# EAGLE design nsl_biz_card (EAGLE 6.4)
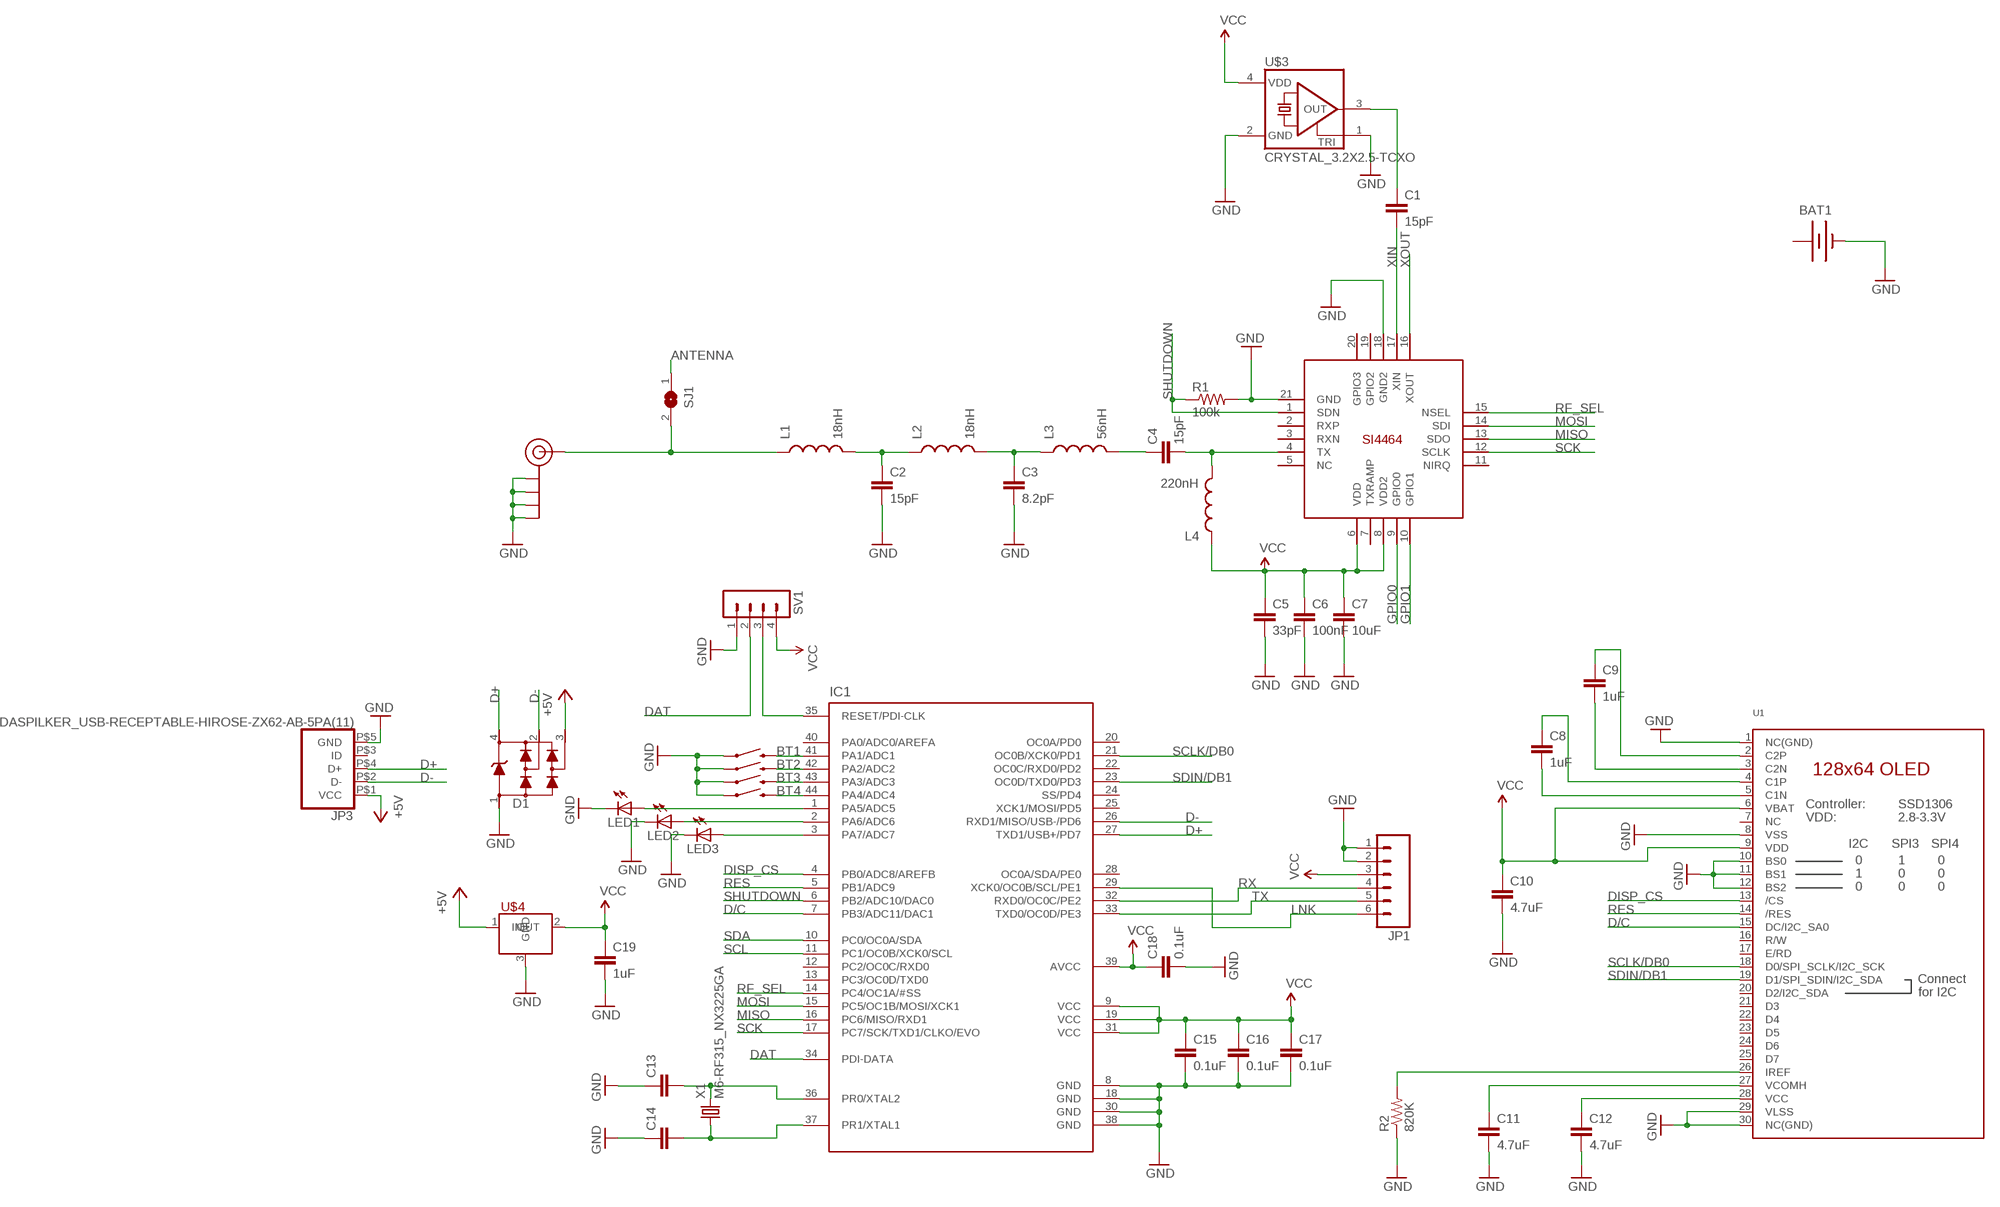
[diagram p0: schematic, sheet 1]

## Parts
BAT1  BATTERY12MM  [BATTCON_12MM]
C1  15pF  CAP0603-CAP  [0603-CAP]
C2  15pF  CAP0603-CAP  [0603-CAP]
C3  8.2pF  CAP0603-CAP  [0603-CAP]
C4  15pF  CAP0603-CAP  [0603-CAP]
C5  33pF  CAP0603-CAP  [0603-CAP]
C6  100nF  CAP0603-CAP  [0603-CAP]
C7  10uF  CAP0603-CAP  [0603-CAP]
C8  1uF  CAP0603-CAP  [0603-CAP]
C9  1uF  CAP0603-CAP  [0603-CAP]
C10  4.7uF  CAP0603-CAP  [0603-CAP]
C11  4.7uF  CAP0603-CAP  [0603-CAP]
C12  4.7uF  CAP0603-CAP  [0603-CAP]
C13  SPARKFUN_CAP0603-CAP  [SPARKFUN_0603-CAP]
C14  SPARKFUN_CAP0603-CAP  [SPARKFUN_0603-CAP]
C15  0.1uF  SPARKFUN_CAP0603-CAP  [SPARKFUN_0603-CAP]
C16  0.1uF  SPARKFUN_CAP0603-CAP  [SPARKFUN_0603-CAP]
C17  0.1uF  SPARKFUN_CAP0603-CAP  [SPARKFUN_0603-CAP]
C18  0.1uF  SPARKFUN_CAP0603-CAP  [SPARKFUN_0603-CAP]
C19  1uF  SPARKFUN_CAP0603-CAP  [SPARKFUN_0603-CAP]
D1  USBUG_PRTR5V0U2X  [USBUG_SOT143B]
IC1  OUTLINE_NONOLITH_ATXMEGAXXA4U-AU  [OUTLINE_NONOLITH_TQFP-44]
J$1  SMA_EDGE  [SMA-EDGE]
JP1  M06SIP  [1X06]
JP3  DASPILKER_USB-RECEPTABLE-HIROSE-ZX62-AB-5PA(11)  [DASPILKER_HIROSE-ZX62-AB-5PA(11)]
L1  18nH  INDUCTOR0603  [0603]
L2  18nH  INDUCTOR0603  [0603]
L3  56nH  INDUCTOR0603  [0603]
L4  220nH  INDUCTOR0603  [0603]
LED1  LED_LEDCHIP-LED0805  [LED_CHIP-LED0805]
LED2  LED_LEDCHIP-LED0805  [LED_CHIP-LED0805]
LED3  LED_LEDCHIP-LED0805  [LED_CHIP-LED0805]
R1  100k  RESISTOR0603-RES  [0603-RES]
R2  820K  RESISTOR0603-RES  [0603-RES]
S1  SWITCH-MOMENTARY-2  [TACTILE_SWITCH_TALL]
S2  SWITCH-MOMENTARY-2  [TACTILE_SWITCH_TALL]
S3  SWITCH-MOMENTARY-2  [TACTILE_SWITCH_TALL]
S4  SWITCH-MOMENTARY-2  [TACTILE_SWITCH_TALL]
SJ1  MICROBUILDER_SOLDERJUMPERREFLOW  [MICROBUILDER_SOLDERJUMPER_REFLOW]
SV1  MA04-1  [MA04-1]
U1  MICROBUILDER_DISP_OLED_UG-2864HSWEG01  [MICROBUILDER_UG-2864HSWEG01_1.3_WRAPAROUND]
U$1  SI4464  [QFN20+GNDPAD]
U$3  CRYSTAL_3.2X2.5-TCXO  [CRYSTAL_3.2X2.5-TCXO]
U$4  SPARKFUN_AP7333-33SOT23-3  [SPARKFUN_SOT23-3]
X1  M6-RF315_NX3225GA  [M6-RF315_NX3225GA]

## Nets
+5V: D1.3 JP3.P$1(VCC) U$4.1(IN)
ANTENNA: SJ1.1
BT1: IC1.41(PA1/ADC1) S4.B2
BT2: IC1.42(PA2/ADC2) S3.B2
BT3: IC1.43(PA3/ADC3) S2.B2
BT4: IC1.44(PA4/ADC4) S1.B2
D+: D1.4 IC1.27(TXD1/USB+/PD7) JP3.P$4(D+)
D-: D1.2 IC1.26(RXD1/MISO/USB-/PD6) JP3.P$2(D-)
D/C: IC1.7(PB3/ADC11/DAC1) U1.15(DC/I2C_SA0)
DAT: IC1.34(PDI-DATA) SV1.2
DISP_CS: IC1.4(PB0/ADC8/AREFB) U1.13(/CS)
GND: BAT1.GND(-) C2.2 C3.2 C5.2 C6.2 C7.2 C10.2 C11.2 C12.2 C13.1 C14.1 C15.2 C16.2 C17.2 C18.2 C19.2 D1.1 IC1.8(GND) IC1.18(GND) IC1.30(GND) IC1.38(GND) J$1.GND@0(GND) J$1.GND@1(GND) J$1.GND@2(GND) J$1.GND@3(GND) JP1.1 JP1.2 JP3.P$5(GND) LED1.C LED2.C LED3.C R1.2 R2.1 S1.A2 S2.A2 S3.A2 S4.A2 SV1.1 U1.1(NC(GND)) U1.8(VSS) U1.10(BS0) U1.11(BS1) U1.12(BS2) U1.29(VLSS) U1.30(NC(GND)) U$1.18(GND2) U$1.21(GND) U$3.1(TRI) U$3.2(GND) U$4.3(GND)
GPIO0: U$1.9(GPIO0)
GPIO1: U$1.10(GPIO1)
LNK: IC1.29(XCK0/OC0B/SCL/PE1) JP1.6
MISO: IC1.16(PC6/MISO/RXD1) U$1.13(SDO)
MOSI: IC1.15(PC5/OC1B/MOSI/XCK1) U$1.14(SDI)
N$2: C1.1 U$3.3(OUT)
N$3: C4.2 L4.2 U$1.4(TX)
N$4: C4.1 L3.2
N$5: C3.1 L2.2 L3.1
N$6: C2.1 L1.2 L2.1
N$7: C13.2 IC1.36(PR0/XTAL2) X1.3
N$8: IC1.3(PA7/ADC7) LED3.A
N$9: C14.2 IC1.37(PR1/XTAL1) X1.1
N$10: IC1.2(PA6/ADC6) LED2.A
N$11: IC1.1(PA5/ADC5) LED1.A
N$12: C12.1 U1.28(VCC)
N$13: IC1.35(RESET/PDI-CLK) SV1.3
N$14: C9.1 U1.2(C2P)
N$15: C9.2 U1.3(C2N)
N$16: C8.1 U1.4(C1P)
N$17: C8.2 U1.5(C1N)
N$18: C11.1 U1.27(VCOMH)
N$19: R2.2 U1.26(IREF)
N$20: J$1.SIG(SIGNAL) L1.1 SJ1.2
RES: IC1.5(PB1/ADC9) U1.14(/RES)
RF_SEL: IC1.14(PC4/OC1A/#SS) U$1.15(NSEL)
RX: IC1.32(RXD0/OC0C/PE2) JP1.4
SCK: IC1.17(PC7/SCK/TXD1/CLKO/EVO) U$1.12(SCLK)
SCL: IC1.11(PC1/OC0B/XCK0/SCL)
SCLK/DB0: IC1.21(OC0B/XCK0/PD1) U1.18(D0/SPI_SCLK/I2C_SCK)
SDA: IC1.10(PC0/OC0A/SDA)
SDIN/DB1: IC1.23(OC0D/TXD0/PD3) U1.19(D1/SPI_SDIN/I2C_SDA)
SHUTDOWN: IC1.6(PB2/ADC10/DAC0) R1.1 U$1.1(SDN)
TX: IC1.33(TXD0/OC0D/PE3) JP1.5
VCC: C5.1 C6.1 C7.1 C10.1 C15.1 C16.1 C17.1 C18.1 C19.1 IC1.9(VCC) IC1.19(VCC) IC1.31(VCC) IC1.39(AVCC) JP1.3 L4.1 SV1.4 U1.6(VBAT) U1.9(VDD) U$1.6(VDD) U$1.8(VDD2) U$3.4(VDD) U$4.2(OUT)
XIN: C1.2 U$1.17(XIN)
XOUT: U$1.16(XOUT)
Unconnected: IC1.12(PC2/OC0C/RXD0) IC1.13(PC3/OC0D/TXD0) IC1.20(OC0A/PD0) IC1.22(OC0C/RXD0/PD2) IC1.24(SS/PD4) IC1.25(XCK1/MOSI/PD5) IC1.28(OC0A/SDA/PE0) IC1.40(PA0/ADC0/AREFA) JP3.P$3(ID) U1.7(NC) U1.16(R/W) U1.17(E/RD) U1.20(D2/I2C_SDA) U1.21(D3) U1.22(D4) U1.23(D5) U1.24(D6) U1.25(D7) U$1.2(RXP) U$1.3(RXN) U$1.5(NC ) U$1.7(TXRAMP) U$1.11(NIRQ) U$1.19(GPIO2) U$1.20(GPIO3)

## Power pins joined to a net without a drawn wire
+: BAT1.PWR@1(+)
DGND: X1.2(DGND) X1.4(DGND)

## Library data of the parts
BAT1 = SparkFun:BATTERY: Battery Holders Various common sizes : AA, AAA, 20mm coin cell and 12mm coin cell.
C1-C12 = SparkFun:CAP: Capacitor Standard 0603 ceramic capacitor, and 0.1" leaded capacitor.
C13-C19 = badge.lbrbadge_2013:SPARKFUN_CAP: Capacitor Standard 0603 ceramic capacitor, and 0.1" leaded capacitor.
D1 = badge.lbrbadge_2013:USBUG_PRTR5V0U2X: Ultra low capacitance double rail-to-rail ESD protection diode
IC1 = badge.lbrbadge_2013:OUTLINE_NONOLITH_ATXMEGAXXA4U: ATXMEGA A4U Series (XMEGA+USB)
J$1 = SparkFun:SMA_EDGE: SMA Antenna Connector End launch SMA connector. The paste layer has been removed so that the connector can be hand soldered onto the board after reflow.
JP1 = SparkFun:M06: Header 6 Standard 6-pin 0.1" header. Use with straight break away headers (SKU : PRT-00116), right angle break away headers (PRT-00553), swiss pins (PRT-00743), machine pins (PRT-00117), and female headers (PRT-00115). Molex polarized connector foot print use with SKU : PRT-08094 with associated crimp pins and housings. NOTES ON THE VARIANTS LOCK and LOCK_LONGPADS... This footprint was designed to help hold the alignment of a through-hole component (i.e. 6-pin header) while soldering it into place. You may notice that each hole has been shifted either up or down by 0.005 of an inch from it's more standard position (which is a perfectly straight line). This slight alteration caused the pins (the squares in the middle) to touch the edges of the holes. Because they are alternating, it causes a "brace" to hold the component in place. 0.005 has proven to be the perfect amount of "off-center" position when using our standard breakaway headers. Although looks a little odd when you look at the bare footprint, once you have a header in there, the alteration is very hard to notice. Also, if you push a header all the way into place, it is covered up entirely on the bottom side. This idea of altering the position of holes to aid alignment will be further integrated into the Sparkfun Library for other footprints. It can help hold any component with 3 or more connection pins.
JP3 = badge.lbrbadge_2013:DASPILKER_USB-RECEPTABLE: USB Receptable
L1-L4 = SparkFun:INDUCTOR: Inductors Basic Inductor/Choke - 0603 and 1206. Footprints are not proven and vary greatly between part numbers.
LED1-LED3 = badge.lbrbadge_2013:LED_LED: LED OSRAM: - CHIPLED LG R971, LG N971, LY N971, LG Q971, LY Q971, LO R971, LY R971 LH N974, LH R974 LS Q976, LO Q976, LY Q976 LO Q996 - Hyper CHIPLED LW Q18S LB Q993, LB Q99A, LB R99A - SideLED LS A670, LO A670, LY A670, LG A670, LP A670 LB A673, LV A673, LT A673, LW A673 LH A674 LY A675 LS A676, LA A676, LO A676, LY A676, LW A676 LS A679, LY A679, LG A679 - Hyper Micro SIDELED® LS Y876, LA Y876, LO Y876, LY Y876 LT Y87S - SmartLED LW L88C, LW L88S LB L89C, LB L89S, LG L890 LS L89K, LO L89K, LY L89K LS L896, LA L896, LO L896, LY L896 - TOPLED LS T670, LO T670, LY T670, LG T670, LP T670 LSG T670, LSP T670, LSY T670, LOP T670, LYG T670 LG T671, LOG T671, LSG T671 LB T673, LV T673, LT T673, LW T673 LH T674 LS T676, LA T676, LO T676, LY T676, LB T676, LH T676, LSB T676, LW T676 LB T67C, LV T67C, LT T67C, LS T67K, LO T67K, LY T67K, LW E67C LS E67B, LA E67B, LO E67B, LY E67B, LB E67C, LV E67C, LT E67C LW T67C LS T679, LY T679, LG T679 LS T770, LO T770, LY T770, LG T770, LP T770 LB T773, LV T773, LT T773, LW T773 LH T774 LS E675, LA E675, LY E675, LS T675 LS T776, LA T776, LO T776, LY T776, LB T776 LHGB T686 LT T68C, LB T68C - Hyper Mini TOPLED® LB M676 - Mini TOPLED Santana® LG M470 LS M47K, LO M47K, LY M47K Source: http://www.osram.convergy.de LUXEON: - LUMILED® LXK2-PW12-R00, LXK2-PW12-S00, LXK2-PW14-U00, LXK2-PW14-V00 LXK2-PM12-R00, LXK2-PM12-S00, LXK2-PM14-U00 LXK2-PE12-Q00, LXK2-PE12-R00, LXK2-PE12-S00, LXK2-PE14-T00, LXK2-PE14-U00 LXK2-PB12-K00, LXK2-PB12-L00, LXK2-PB12-M00, LXK2-PB14-N00, LXK2-PB14-P00, LXK2-PB14-Q00 LXK2-PR12-L00, LXK2-PR12-M00, LXK2-PR14-Q00, LXK2-PR14-R00 LXK2-PD12-Q00, LXK2-PD12-R00, LXK2-PD12-S00 LXK2-PH12-R00, LXK2-PH12-S00 LXK2-PL12-P00, LXK2-PL12-Q00, LXK2-PL12-R00 Source: www.luxeon.com KINGBRIGHT: KA-3528ASYC Source: www.kingbright.com
R1 R2 = SparkFun:RESISTOR: Resistor Basic schematic elements and footprints for 0603, 1206, and PTH resistors.
S1-S4 = SparkFun:SWITCH-MOMENTARY-2
SJ1 = badge.lbrbadge_2013:MICROBUILDER_SOLDERJUMPER: SMD Solder JUMPER Solder the two pads together to create a connection, or remove the solder to break it. REFLOW - Use this footprint for solder paste and reflow ovens. WAVE - Use this footprint for hand-soldering (larger pads). CLOSED - Has a trace between the two pads to ensure it is closed by default. The trace needs to be cut to disable the jumper, and can be closed again by creating a solder bridge between the two pads.
SV1 = con-lstb:MA04-1: PIN HEADER; OC_FARNELL: unknown; OC_NEWARK: unknown
U1 = badge.lbrbadge_2013:MICROBUILDER_DISP_OLED_UG-2864HSWEG01: UG-2864HSWEG01 OLED display Both 1.3" and 0.96" models share the same FPC tab footprint, only the screen dimensions vary.
U$1 = Ava:SI4464
U$3 = picoAVA-R8:CRYSTAL_3.2X2.5-TCXO
U$4 = badge.lbrbadge_2013:SPARKFUN_AP7333-33: AP7333-33 300mA, Low Quiescent Current, Fast Transient Low Dropout Linear Regulator
X1 = badge.lbrbadge_2013:M6-RF315_NX3225GA: NX3225GA Crystal oscillator NDK NX3225GA small surface-mount type crystal unit in compact and thin 3.2 x 2.5 x 0.75 mm package. Source: http://www.ndk.com/images/products/catalog/c_NX3225GA-STD-CRG-1_e.pdf

## Board
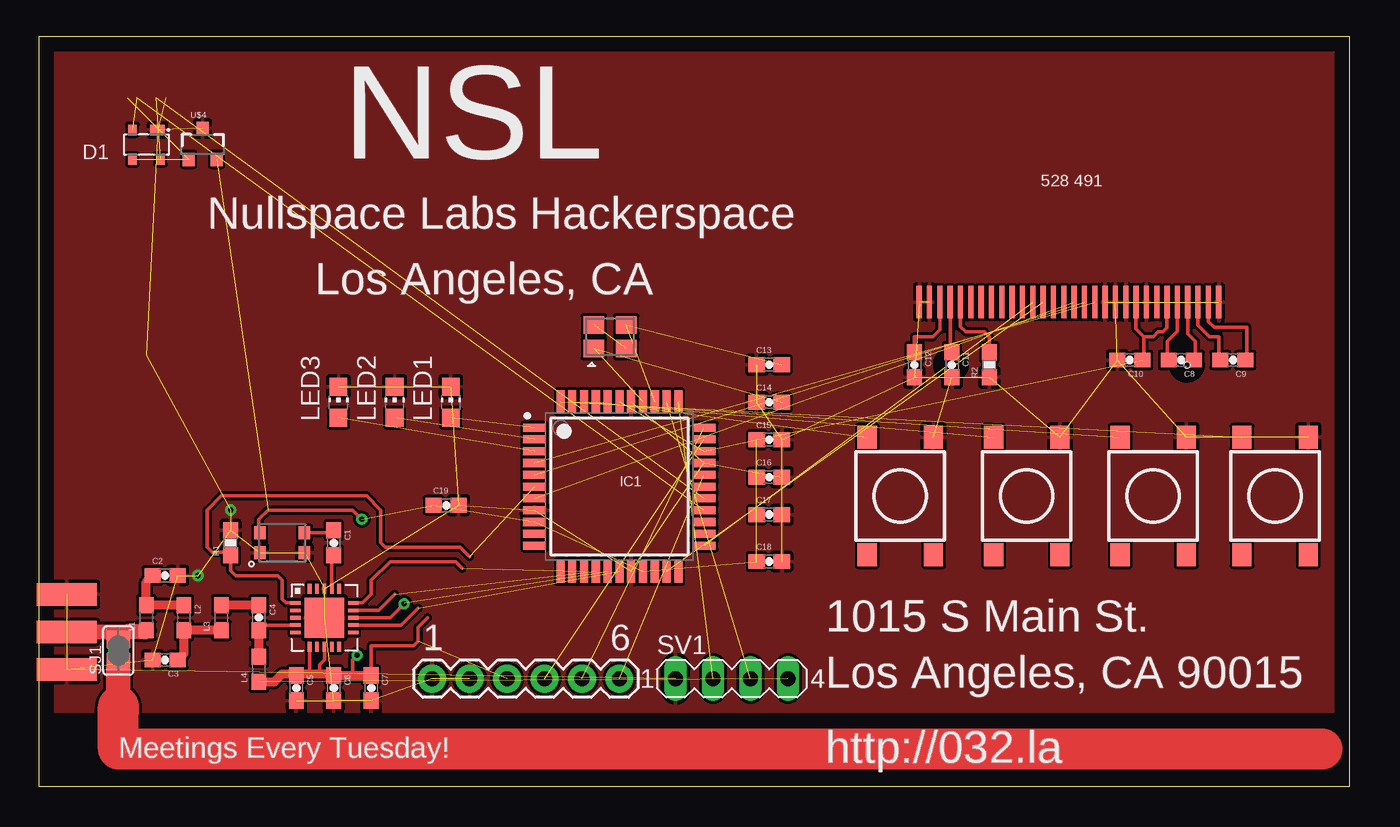
[diagram p1: board, top side]
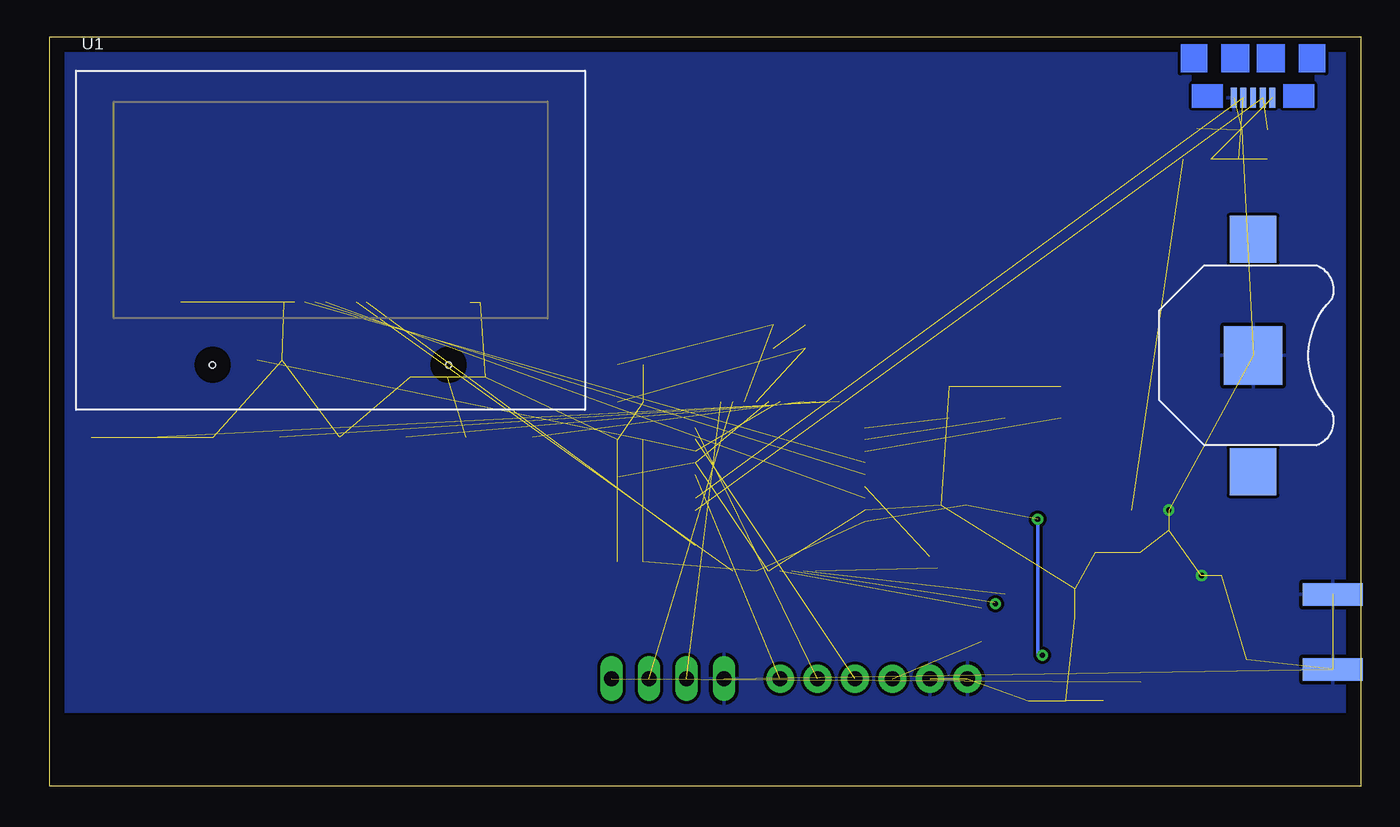
[diagram p2: board, bottom side, seen from below]

Size 88.9 x 50.8 mm. Coordinates in mm from the lower left corner, seen from the top.
Outline: 0,0 88.9,0 88.9,50.8 0,50.8 0,0
Copper layers (1*16): Top 0.035mm / dielectric 1.5mm / Bottom 0.035mm
Design rules "default": minimum track width 10mil, minimum drill 24mil, track to track 8mil, track to pad 8mil, pad to pad 8mil, via to via 8mil, smd to smd 8mil, copper to edge 40mil, drill to drill 8mil, minimum pad ring 10mil, minimum via ring 8mil, stop-mask expansion 4mil, vias tented up to drill 0mil, thermal gap 10mil

### Footprints (pad centres in the part's own frame; a part is rotated, then mirrored left to right if it is on the bottom)
BATTCON_12MM = smd 3.962 x 3.962: GND 0,0 | smd 3.175 x 3.175: PWR@1 -7.874,0; PWR@2 7.874,0
0603-CAP = smd 1.1 x 1: 1 -0.85,0; 2 0.85,0
SPARKFUN_0603-CAP = smd 1.1 x 1: 1 -0.85,0; 2 0.85,0
USBUG_SOT143B = smd 1 x 0.7: 1 -0.75,-1 | smd 0.6 x 0.7: 2 0.95,-1; 3 0.95,1; 4 -0.95,1
OUTLINE_NONOLITH_TQFP-44 = smd 1.55 x 0.55: 1 -5.75,4; 2 -5.75,3.2; 3 -5.75,2.4; 4 -5.75,1.6; 5 -5.75,0.8; 6 -5.75,0; 7 -5.75,-0.8; 8 -5.75,-1.6; 9 -5.75,-2.4; 10 -5.75,-3.2; 11 -5.75,-4; 23 5.75,-4; 24 5.75,-3.2; 25 5.75,-2.4; 26 5.75,-1.6; 27 5.75,-0.8; 28 5.75,0; 29 5.75,0.8; 30 5.75,1.6; 31 5.75,2.4; 32 5.75,3.2; 33 5.75,4 | smd 0.55 x 1.55: 12 -4,-5.75; 13 -3.2,-5.75; 14 -2.4,-5.75; 15 -1.6,-5.75; 16 -0.8,-5.75; 17 0,-5.75; 18 0.8,-5.75; 19 1.6,-5.75; 20 2.4,-5.75; 21 3.2,-5.75; 22 4,-5.75; 34 4,5.75; 35 3.2,5.75; 36 2.4,5.75; 37 1.6,5.75; 38 0.8,5.75; 39 0,5.75; 40 -0.8,5.75; 41 -1.6,5.75; 42 -2.4,5.75; 43 -3.2,5.75; 44 -4,5.75
SMA-EDGE = smd 1.524 x 4.064: GND@0 0,0; GND@1 5.08,0; SIG 2.54,0 | smd 1.524 x 4.064 bottom: GND@2 0,0; GND@3 5.08,0
1X06 = drill 1.016 pad 1.88: 1 0,0; 2 2.54,0; 3 5.08,0; 4 7.62,0; 5 10.16,0; 6 12.7,0
DASPILKER_HIROSE-ZX62-AB-5PA(11) = smd 0.4 x 1.35 bottom: P$1 1.3,4.125; P$2 0.65,4.125; P$3 0,4.125; P$4 -0.65,4.125; P$5 -1.3,4.125
0603 = smd 1.1 x 1: 1 -0.85,0; 2 0.85,0
LED_CHIP-LED0805 = smd 1.2 x 1.2: A 0,-1.05; C 0,1.05
0603-RES = smd 1.1 x 1: 1 -0.85,0; 2 0.85,0
TACTILE_SWITCH_TALL = smd 1.55 x 1.3: A1 -3.975,-2.25; A2 3.975,-2.25; B1 -3.975,2.25; B2 3.975,2.25
MICROBUILDER_SOLDERJUMPER_REFLOW = smd 1.168 x 1.6: 1 -0.762,0; 2 0.762,0
MA04-1 = drill 1.016 long: 1 -3.81,0; 2 -1.27,0; 3 1.27,0; 4 3.81,0
MICROBUILDER_UG-2864HSWEG01_1.3_WRAPAROUND = smd 0.35 x 2.2 bottom: 1 -10.15,-0.2; 2 -9.45,-0.2; 3 -8.75,-0.2; 4 -8.05,-0.2; 5 -7.35,-0.2; 6 -6.65,-0.2; 7 -5.95,-0.2; 8 -5.25,-0.2; 9 -4.55,-0.2; 10 -3.85,-0.2; 11 -3.15,-0.2; 12 -2.45,-0.2; 13 -1.75,-0.2; 14 -1.05,-0.2; 15 -0.35,-0.2; 16 0.35,-0.2; 17 1.05,-0.2; 18 1.75,-0.2; 19 2.45,-0.2; 20 3.15,-0.2; 21 3.85,-0.2; 22 4.55,-0.2; 23 5.25,-0.2; 24 5.95,-0.2; 25 6.65,-0.2; 26 7.35,-0.2; 27 8.05,-0.2; 28 8.75,-0.2; 29 9.45,-0.2; 30 10.15,-0.2 | hole 0.4: -8,-4.45; 8,-4.45
QFN20+GNDPAD = smd 0.7 x 0.25: 1 -1.97,1; 2 -1.97,0.5; 3 -1.97,0; 4 -1.97,-0.5; 5 -1.97,-1; 11 1.97,-1; 12 1.97,-0.5; 13 1.97,0; 14 1.97,0.5; 15 1.97,1 | smd 0.25 x 0.7: 6 -1,-1.97; 7 -0.5,-1.97; 8 0,-1.97; 9 0.5,-1.97; 10 1,-1.97; 16 1,1.97; 17 0.5,1.97; 18 0,1.97; 19 -0.5,1.97; 20 -1,1.97 | smd 2.7 x 2.7: 21 0,0
CRYSTAL_3.2X2.5-TCXO = smd 0.78 x 0.87: 1 -1.515,-0.68; 2 1.515,-0.68; 3 1.515,0.68; 4 -1.515,0.68
SPARKFUN_SOT23-3 = smd 0.8 x 0.9: 1 -0.95,-1; 2 0.95,-1; 3 0,1.1
M6-RF315_NX3225GA = smd 1.4 x 1.2: 1 -1.1,-0.8; 2 1.1,-0.8; 3 1.1,0.8; 4 -1.1,0.8

### Placement (x,y rotation side)
BAT1  7.3,29.21 270 bottom
C1  20,16.51 270 top
C2  8.57,14.29 0 top
C3  8.57,8.57 180 top
C4  14.92,11.43 270 top
C5  17.46,6.67 270 top
C6  20,6.67 270 top
C7  22.54,6.67 270 top
C8  77.47,28.89 180 top
C9  80.96,28.89 180 top
C10  73.98,28.89 180 top
C11  61.91,28.57 270 top
C12  59.37,28.57 270 top
C13  49.53,28.57 0 top
C14  49.53,26.04 0 top
C15  49.53,23.5 0 top
C16  49.53,20.95 0 top
C17  49.53,18.41 0 top
C18  49.53,15.24 0 top
C19  27.62,19.05 0 top
D1  7.3,43.5 180 top
IC1  39.37,20.32 0 top
J$1  1.91,7.94 90 top
JP1  26.67,7.3 0 top
JP3  7.3,50.8 180 top
L1  7.3,11.43 90 top
L2  9.84,11.43 270 top
L3  12.38,11.43 90 top
L4  14.92,7.94 90 top
LED1  27.94,26.04 0 top
LED2  24.13,26.04 0 top
LED3  20.32,26.04 0 top
R1  13.02,16.51 90 top
R2  64.45,28.57 90 top
S1  83.82,19.68 90 top
S2  75.56,19.68 90 top
S3  66.99,19.68 90 top
S4  58.42,19.68 90 top
SJ1  5.4,9.21 90 top
SV1  46.99,7.3 0 top
U1  69.85,33.02 0 bottom
U$1  19.37,11.43 0 top
U$3  16.51,16.51 0 top
U$4  11.11,43.5 0 top
X1  38.73,30.48 0 top

### Tracks (layer width: path | path; a pad name or v marks a point on that pad's centre or on a via)
+5V  (2 unrouted)
BT1  (1 unrouted)
BT2  (1 unrouted)
BT3  (1 unrouted)
BT4  (1 unrouted)
D+  (2 unrouted)
D-  (2 unrouted)
D/C  (1 unrouted)
DAT  (1 unrouted)
DGND  (1 unrouted)
DISP_CS  (1 unrouted)
GND  (via drill 0.36)  (51 unrouted)
  other vias: 13.02,18.73 10.79,14.29
  pour Top: 0,50.8 88.9,50.8 88.9,5.08 0,5.08
  pour Bottom: 0,50.8 88.9,50.8 88.9,5.08 0,5.08
LNK  (1 unrouted)
MISO  (via drill 0.36)  (1 unrouted)
  Top 0.254: U$1.13 23.81,11.43 v24.77,12.38 24.81,12.43
MOSI  (1 unrouted)
  Top 0.254: U$1.14 23.04,11.93 24.13,13.02
N$2
  Top 0.254: U$3.3 19.83,17.19 C1.1
N$3
  Top 0.254: U$1.4 15.27,10.93 C4.2
  Top 0.61: C4.2 L4.2
N$4
  Top 0.61: C4.1 L3.2
N$5
  Top 0.61: L3.1 L2.2 9.84,8.99 C3.1
N$6
  Top 0.61: L2.1 L1.2 7.3,13.87 C2.1
N$7  (2 unrouted)
N$8  (1 unrouted)
N$9  (2 unrouted)
N$10  (1 unrouted)
N$11  (1 unrouted)
N$12
  Top 0.254: U1.28 61.1,30.94 60.64,30.48 59.37,30.48 C12.1
N$13  (1 unrouted)
N$14
  Top 0.254: U1.2 79.3,31.51 79.69,31.11 81.92,31.11 81.92,29 C9.1
N$15
  Top 0.254: U1.3 78.6,31.25 79.38,30.48 80.01,30.48 80.01,29 C9.2
N$16
  Top 0.254: U1.4 77.9,30.68 78.42,30.16 78.42,29 C8.1
N$17
  Top 0.254: U1.5 77.2,30.84 76.52,30.16 76.52,29 C8.2
N$18
  Top 0.254: U1.27 61.8,29.54 C11.1
N$19
  Top 0.254: U1.26 62.5,31.16 62.87,30.8 64.14,30.8 64.45,30.48 R2.2
N$20
  Top 1.016: J$1.SIG 5.91,10.48 | L1.1 7.2,10.48 5.91,10.48 | 5.91,10.48 SJ1.2
N$21
  Top 1.676: 5.4,7.94 5.4,5.08
  Top 2.769: 87,2.54 5.4,2.54 5.4,5.08 5.4,5.4
RES  (1 unrouted)
RF_SEL  (1 unrouted)
  Top 0.254: U$1.15 21.95,12.43 22.54,13.02 22.54,13.97 23.81,15.24 28.26,15.24 28.71,14.79
RX  (1 unrouted)
SCK  (1 unrouted)
  Top 0.254: U$1.12 24.58,10.93 25.72,12.06
SCLK/DB0  (1 unrouted)
SDIN/DB1  (1 unrouted)
SHUTDOWN  (1 unrouted)
  Top 0.254: U$1.1 16.78,12.43 16.51,12.7 16.51,13.97 16.19,14.29 13.34,14.29 13.02,14.61 R1.1 12.8,15.88 11.75,15.88 11.43,16.19 11.43,18.73 12.38,19.68 22.23,19.68 23.18,18.73 23.18,16.51 23.5,16.19 28.57,16.19 29.21,15.56
TX  (1 unrouted)
VCC  (via drill 0.36)  (13 unrouted)
  Top 0.254: U$1.6 18.37,7.89 18.1,7.62 | U$1.8 19.37,8.57 19.05,8.26 19.05,7.62 | C7.1 22.54,9.53 25.4,9.53 25.72,9.84 25.72,10.79 26.35,11.43 | U1.9 74.4,31.01 74.93,30.48 | 74.93,30.48 74.93,29 C10.1 | U1.6 76.5,31.1 76.2,30.8 75.88,30.8 75.56,30.48 74.93,30.48 | U$3.4 14.92,17.19 14.92,18.1 15.56,18.73 21.27,18.73 v21.91,18.1 | v21.59,8.89 21.27,8.57 21.27,7.52
  Top 0.61: L4.1 15.98,7.09 16.51,7.62 17.36,7.62 | 17.36,7.62 C5.1 | 17.36,7.62 18.1,7.62 19.05,7.62 19.9,7.62 C6.1 21.27,7.52 C7.1
  Bottom 0.254: v21.91,18.1 21.91,8.89 v21.59,8.89
XIN
  Top 0.254: U$1.17 19.87,15.53 C1.2

### Text on the board
tNames: NSL | 528 491 | Nullspace Labs Hackerspace | Los Angeles, CA | 1015 S Main St. | 1 | 6 | Los Angeles, CA 90015 | Meetings Every Tuesday! | http://032.la